# Altium schematic sheet 28. BOARD ID & 40 Pin EXP Hdr.SchDoc: BOARD ID EEPROM & 40 PIN EXP HEADER
size 513 x 386 mm; Project: PROC154E2(001)_SK_AM69; Issue: 1.0; RevCode: E3; Page Create Date: March  8, 1995; Variant Name: Core Design; Schematic Page Number: 28; Page Number: 28; Page Size: C; Comment: MISTRAL_TITLEBLK_CSIZE_1; Page Count: 62; Schematic Page Count: 62; Name: PROC154E2 001 SK AM69; DsnPath: C:\Users\danie\Downloads\sprr466c\PROC154E3_RP\PROC154E3_SCH.DSN; SchematicName: SCHEMATIC1; PageName: 28. BOARD ID & 40 Pin EXP Hdr; PageSize: C; TopSchematic: True
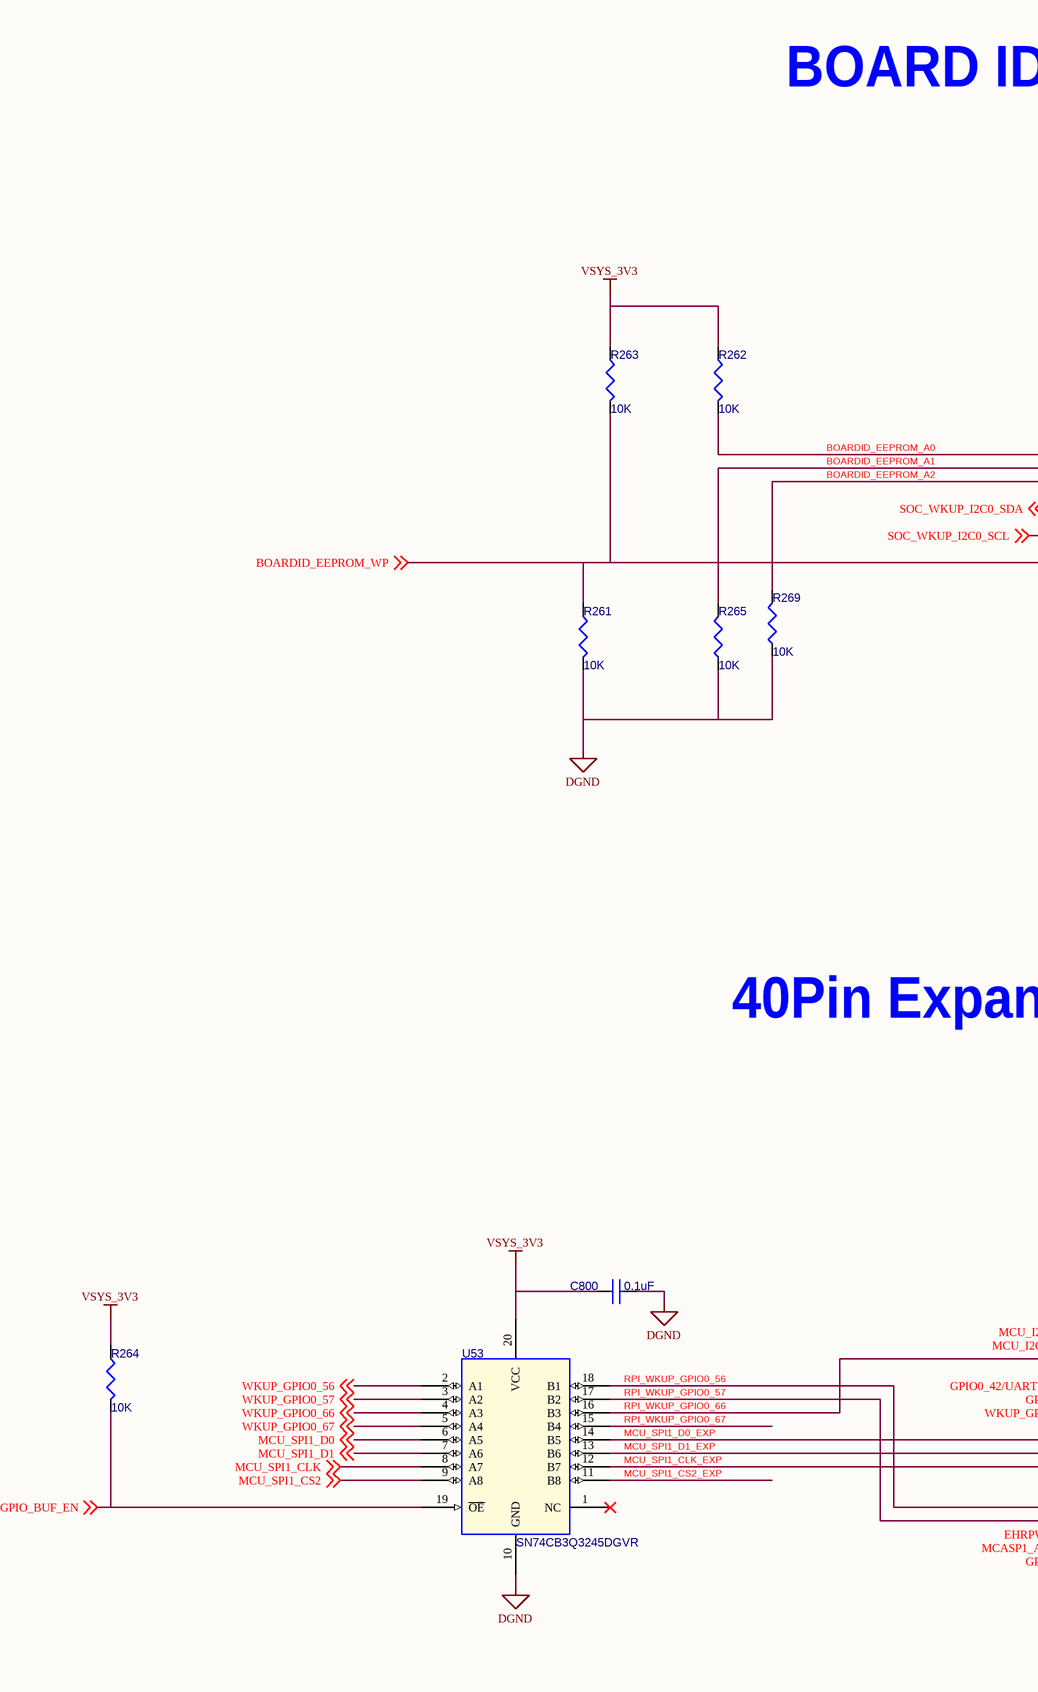
[diagram p0: 28. BOARD ID & 40 Pin EXP Hdr.SchDoc, left]
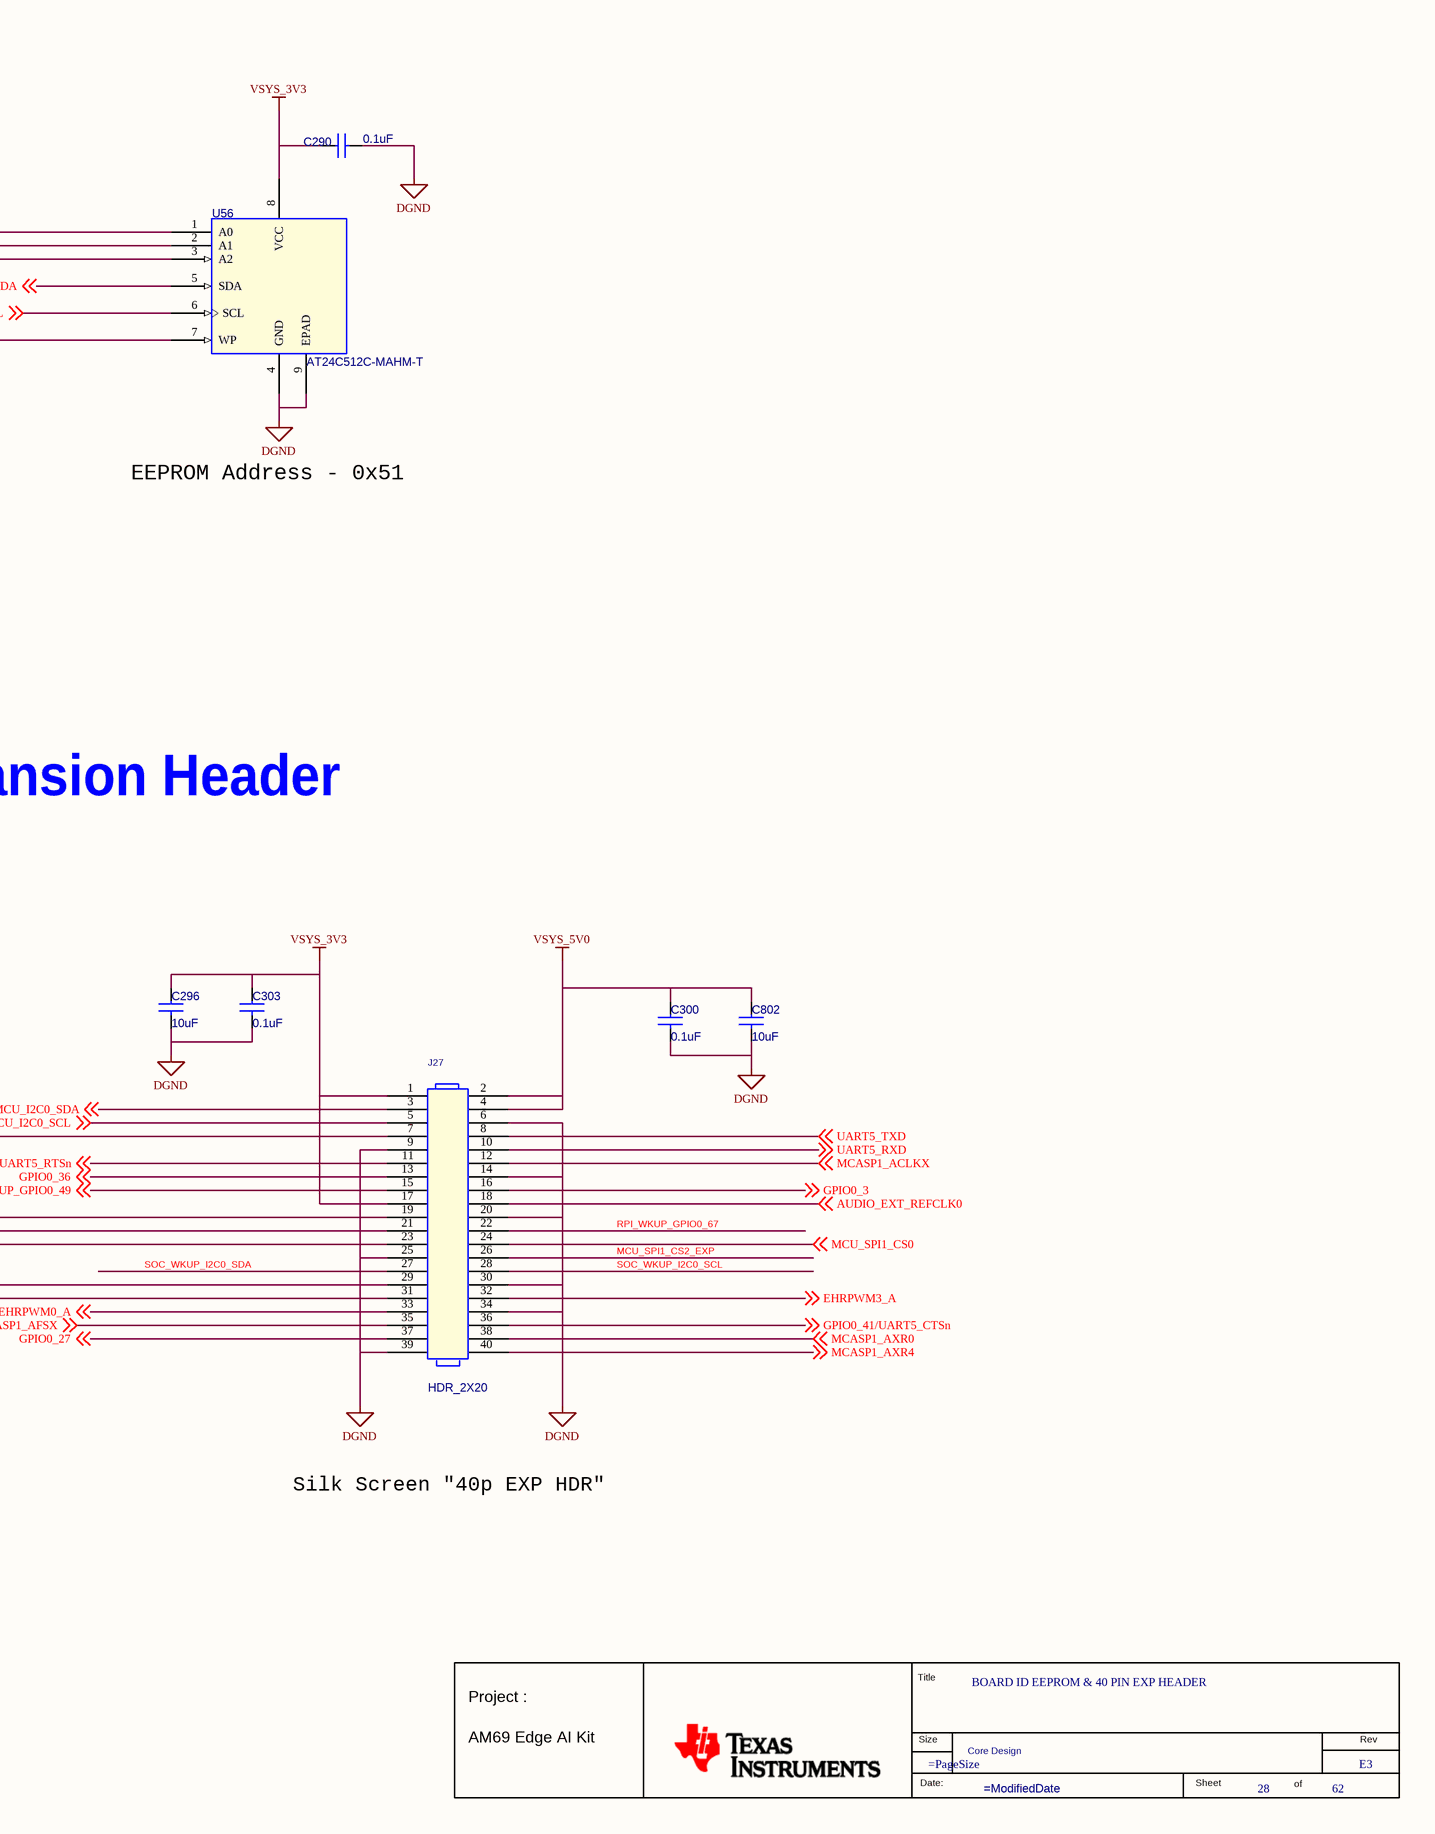
[diagram p1: 28. BOARD ID & 40 Pin EXP Hdr.SchDoc, right]

## Parts
*  RevCode: E3  Title: BOARD ID EEPROM & 40 PIN EXP HEADER  Page Number: 28  Page Count: 62  Variant Name: Core Design  (hidden comment: MISTRAL_TITLEBLK_CSIZE_1)  (graphical)
C290  0.1uF  [CAP0201_0-5]
C296  10uF  [CAP0402_1]
C300  0.1uF  [CAP0201_0-5]
C303  0.1uF  [CAP0201_0-5]
C800  0.1uF  [CAP0201_0-5]
C802  10uF  [CAP0402_1]
J27  HDR_2X20  [HDR_2X20_61304021121_S_T_8-6]
R261  10K  [RES0201_0-5]
R262  10K  [RES0201_0-5]
R263  10K  [RES0201_0-5]
R264  10K  [RES0201_0-5]
R265  10K  [RES0201_0-5]
R269  10K  [RES0201_0-5]
U53  SN74CB3Q3245DGVR  [TVSOP20_15-74_180X200]
U56  AT24C512C-MAHM-T  [UDFN8_19-68_120X80_0-6]

## Nets
DGND: C290.2 C296.2 C300.2 C303.2 C800.2 C802.2 J27.6 J27.9 J27.14 J27.20 J27.25 J27.30 J27.34 J27.39 R261.2 R265.1 R269.1 U53.10(GND) U56.4(GND) U56.9(EPAD)
VSYS_3V3: C290.1 C296.1 C303.1 C800.1 J27.1 J27.17 R262.1 R263.1 R264.1 U53.20(VCC) U56.8(VCC)
VSYS_5V0: C300.1 C802.1 J27.2 J27.4
AUDIO_EXT_REFCLK0: J27.18 ; off-sheet AUDIO_EXT_REFCLK0
BOARDID_EEPROM_A0: R262.2 U56.1(A0)
BOARDID_EEPROM_A1: R265.2 U56.2(A1)
BOARDID_EEPROM_A2: R269.2 U56.3(A2)
BOARDID_EEPROM_WP: R261.1 R263.2 U56.7(WP) ; off-sheet BOARDID_EEPROM_WP
EHRPWM0_A: J27.33 ; off-sheet EHRPWM0_A
EHRPWM3_A: J27.32 ; off-sheet EHRPWM3_A
GPIO0_3: J27.16 ; off-sheet GPIO0_3
GPIO0_27: J27.37 ; off-sheet GPIO0_27
GPIO0_36: J27.13 ; off-sheet GPIO0_36
GPIO0_41/UART5_CTSn: J27.36 ; off-sheet GPIO0_41/UART5_CTSn
GPIO0_42/UART5_RTSn: J27.11 ; off-sheet GPIO0_42/UART5_RTSn
MCASP1_ACLKX: J27.12 ; off-sheet MCASP1_ACLKX
MCASP1_AFSX: J27.35 ; off-sheet MCASP1_AFSX
MCASP1_AXR0: J27.38 ; off-sheet MCASP1_AXR0
MCASP1_AXR4: J27.40 ; off-sheet MCASP1_AXR4
MCU_I2C0_SCL: J27.5 ; off-sheet MCU_I2C0_SCL
MCU_I2C0_SDA: J27.3 ; off-sheet MCU_I2C0_SDA
MCU_SPI1_CLK: U53.8(A7) ; off-sheet MCU_SPI1_CLK
MCU_SPI1_CLK_EXP: J27.23 U53.12(B7)
MCU_SPI1_CS0: J27.24 ; off-sheet MCU_SPI1_CS0
MCU_SPI1_CS2: U53.9(A8) ; off-sheet MCU_SPI1_CS2
MCU_SPI1_CS2_EXP: J27.26 U53.11(B8)
MCU_SPI1_D0: U53.6(A5) ; off-sheet MCU_SPI1_D0
MCU_SPI1_D0_EXP: J27.19 U53.14(B5)
MCU_SPI1_D1: U53.7(A6) ; off-sheet MCU_SPI1_D1
MCU_SPI1_D1_EXP: J27.21 U53.13(B6)
RPi_GPIO_BUF_EN: R264.2 U53.19(~{OE}) ; off-sheet RPi_GPIO_BUF_EN
RPI_WKUP_GPIO0_56: J27.29 U53.18(B1)
RPI_WKUP_GPIO0_57: J27.31 U53.17(B2)
RPI_WKUP_GPIO0_66: J27.7 U53.16(B3)
RPI_WKUP_GPIO0_67: J27.22 U53.15(B4)
SOC_WKUP_I2C0_SCL: J27.28 U56.6(SCL) ; off-sheet SOC_WKUP_I2C0_SCL
SOC_WKUP_I2C0_SDA: J27.27 U56.5(SDA) ; off-sheet SOC_WKUP_I2C0_SDA
UART5_RXD: J27.10 ; off-sheet UART5_RXD
UART5_TXD: J27.8 ; off-sheet UART5_TXD
WKUP_GPIO0_49: J27.15 ; off-sheet WKUP_GPIO0_49
WKUP_GPIO0_56: U53.2(A1) ; off-sheet WKUP_GPIO0_56
WKUP_GPIO0_57: U53.3(A2) ; off-sheet WKUP_GPIO0_57
WKUP_GPIO0_66: U53.4(A3) ; off-sheet WKUP_GPIO0_66
WKUP_GPIO0_67: U53.5(A4) ; off-sheet WKUP_GPIO0_67

Not connected (* = marked no-connect by the designer): U53 1(NC)*

## Notes on the sheet
- BOARD ID EEPROM
- EEPROM Address - 0x51
- 40Pin Expansion Header
- Silk Screen "40p EXP HDR"
- (in symbol MISTRAL_TITLEBLK_CSIZE_1) Title; Project :; Size; Rev; AM69 Edge AI Kit; Date:; Sheet; of

## Library data of the parts
* = MISTRAL_TITLEBLK_CSIZE_1: Issue: 1.0; Project: PROC154E2(001)_SK_AM69; Name: PROC154E2 001 SK AM69; Page Create Date: March  8, 1995; Page Size: =PageSize; Page Modify Date: =ModifiedDate; Schematic Page Count: 62; Schematic Page Number: 28
C290 = CAP_Dup1: CAP CERAMIC 0.1uF 16V 10% X7S AUTO 0201; Part Reference: C290; Mistral Part No: 120021030007-R; Mfr_name: MURATA; Mfr_part_number: GRT033C71C104KE01D; Part_type: CAPACITORS\CERAMIC; Project: J7ES_SK_BRD; Wattage: NA; Customs_HS_Code: 85322990; Custom_Duty: 15%; Value: 0.1uF; Tolerance: 10%; Voltage: 16V; Package: 0201; Distributor_name: DIGIKEY; Distributor_part_number: 490-GRT033C71C104KE01DTR-ND; Height: 0.33MM; Weight: 330mg; Temperature: -55°C+125°C; Datasheet: Y:\MIS_DATABASE\DATASHEETS\CAPACITORS\GRT033C71C104KE01.PDF; Crtd /date: ALVY/110321; Chkd/date: MANIRAJA/110321; MECHANICAL 3D STEP FILE: CAP0201_0-5; PCB Footprint: CAP0201_0-5
C296 = CAP_Dup1: CAP CERAMIC 10uF 10V 20% X5R 0402; Part Reference: C296; Part_type: CAPACITORS\CERAMIC; Mfr_part_number: CL05A106MP8NUB8; Mfr_name: SAMSUNG; Mistral Part No: 120019020008-R; Custom_Duty: 15%; Customs_HS_Code: 85322990; Wattage: NA; Project: TI_60GHz-AOP; Value: 10uF; PCB Footprint: CAP0402_1; Footprint Path: Y:\MIS_DATABASE\Library\ALTIUM_TOOL\PCB_FOOTPRINTS\Altium_Footprint_Lib.PcbLib; Library Path: Y:\MIS_DATABASE\Library\ALTIUM_TOOL\SCHEMATICS_PARTS\MS_DISCRETE_Library.schlib; MECHANICAL 3D STEP FILE: CAP0402_1; Chkd/date: MANIRAJA/150219; Crtd /date: ALVY/150219; Datasheet: Y:\MIS_DATABASE\DATASHEETS\CAPACITORS\CL05A106MP8NUB8.PDF; Temperature: -55°C+85°C; Weight: NA; Height: 0.90MM; Footprint Ref: CAP0402_1; Library Ref: CAP; Distributor_part_number: 1276-6830-1-ND; Distributor_name: DIGIKEY; Package: 0402; Voltage: 10V; Tolerance: 20%
C300 = CAP_Dup1: CAP CERAMIC 0.1uF 16V 10% X7S AUTO 0201; Part Reference: C300; Part_type: CAPACITORS\CERAMIC; Mfr_part_number: GRT033C71C104KE01D; Mfr_name: MURATA; Mistral Part No: 120021030007-R; Custom_Duty: 15%; Customs_HS_Code: 85322990; Wattage: NA; Project: J7ES_SK_BRD; Value: 0.1uF; PCB Footprint: CAP0201_0-5; MECHANICAL 3D STEP FILE: CAP0201_0-5; Chkd/date: MANIRAJA/110321; Crtd /date: ALVY/110321; Datasheet: Y:\MIS_DATABASE\DATASHEETS\CAPACITORS\GRT033C71C104KE01.PDF; Temperature: -55°C+125°C; Weight: 330mg; Height: 0.33MM; Distributor_part_number: 490-GRT033C71C104KE01DTR-ND; Distributor_name: DIGIKEY; Package: 0201; Voltage: 16V; Tolerance: 10%
C303 = CAP_Dup1: CAP CERAMIC 0.1uF 16V 10% X7S AUTO 0201; Part Reference: C303; Mistral Part No: 120021030007-R; Mfr_name: MURATA; Mfr_part_number: GRT033C71C104KE01D; Part_type: CAPACITORS\CERAMIC; Project: J7ES_SK_BRD; Wattage: NA; Customs_HS_Code: 85322990; Custom_Duty: 15%; Value: 0.1uF; PCB Footprint: CAP0201_0-5; Tolerance: 10%; Voltage: 16V; Package: 0201; Distributor_name: DIGIKEY; Distributor_part_number: 490-GRT033C71C104KE01DTR-ND; Height: 0.33MM; Weight: 330mg; Temperature: -55°C+125°C; Datasheet: Y:\MIS_DATABASE\DATASHEETS\CAPACITORS\GRT033C71C104KE01.PDF; Crtd /date: ALVY/110321; Chkd/date: MANIRAJA/110321; MECHANICAL 3D STEP FILE: CAP0201_0-5
C800 = CAP_Dup1: CAP CERAMIC 0.1uF 16V 10% X7S AUTO 0201; Part Reference: C800; Mistral Part No: 120021030007-R; Mfr_name: MURATA; Mfr_part_number: GRT033C71C104KE01D; Part_type: CAPACITORS\CERAMIC; Project: J7ES_SK_BRD; Wattage: NA; Customs_HS_Code: 85322990; Custom_Duty: 15%; Value: 0.1uF; PCB Footprint: CAP0201_0-5; Tolerance: 10%; Voltage: 16V; Package: 0201; Distributor_name: DIGIKEY; Distributor_part_number: 490-GRT033C71C104KE01DTR-ND; Height: 0.33MM; Weight: 330mg; Temperature: -55°C+125°C; Datasheet: Y:\MIS_DATABASE\DATASHEETS\CAPACITORS\GRT033C71C104KE01.PDF; Crtd /date: ALVY/110321; Chkd/date: MANIRAJA/110321; MECHANICAL 3D STEP FILE: CAP0201_0-5
C802 = CAP_Dup1: CAP CERAMIC 10uF 10V 20% X5R 0402; Part Reference: C802; Mistral Part No: 120019020008-R; Mfr_name: SAMSUNG; Mfr_part_number: CL05A106MP8NUB8; Part_type: CAPACITORS\CERAMIC; Project: TI_60GHz-AOP; Wattage: NA; Customs_HS_Code: 85322990; Custom_Duty: 15%; Value: 10uF; PCB Footprint: CAP0402_1; Tolerance: 20%; Voltage: 10V; Package: 0402; Distributor_name: DIGIKEY; Distributor_part_number: 1276-6830-1-ND; Library Ref: CAP; Footprint Ref: CAP0402_1; Height: 0.90MM; Weight: NA; Temperature: -55°C+85°C; Datasheet: Y:\MIS_DATABASE\DATASHEETS\CAPACITORS\CL05A106MP8NUB8.PDF; Crtd /date: ALVY/150219; Chkd/date: MANIRAJA/150219; MECHANICAL 3D STEP FILE: CAP0402_1; Library Path: Y:\MIS_DATABASE\Library\ALTIUM_TOOL\SCHEMATICS_PARTS\MS_DISCRETE_Library.schlib; Footprint Path: Y:\MIS_DATABASE\Library\ALTIUM_TOOL\PCB_FOOTPRINTS\Altium_Footprint_Lib.PcbLib
J27 = HEADER_20X2: CON HDR 2X20 2.54MM PITCH ST TH; Part Reference: J27; Mistral Part No: 150021010011-R; Mfr_name: WURTH ELEKTRONIK; Mfr_part_number: 61304021121; Part_type: CONNECTOR\HEADERS; Project: TI_DRA829 SK EVM BRD; Tolerance: NA; Customs_HS_Code: 85369090; Custom_Duty: 24%; Value: HDR_2X20; PCB Footprint: HDR_2X20_61304021121_S_T_8-6; Footprint Ref: HDR_2X20_61304021121_S_T_8-6; Voltage: NA; Wattage: NA; Package: THRU-HOLE; Distributor_name: DIGIKEY; Distributor_part_number: 732-5310-ND; Library Ref: HEADER_20X2; Height: 8.54MM; Weight: 2250mg; Temperature: -40°C+105°C; Datasheet: Y:\MIS_DATABASE\DATASHEETS\CONNECTORS\6130XX21121.PDF; Crtd /date: ALVY/070121; Chkd/date: MANIRAJA/080121; MECHANICAL 3D STEP FILE: HDR_2X20_61304021121_S_T_8-6; Library Path: Y:\MIS_DATABASE\Library\ALTIUM_TOOL\SCHEMATICS_PARTS\MS_CONNECTOR_Library.schlib; Footprint Path: Y:\MIS_DATABASE\Library\ALTIUM_TOOL\PCB_FOOTPRINTS\Altium_Footprint_Lib.PcbLib
R261 = RESISTOR_Dup2: RES 10K 1/20W 5% 0201; Part Reference: R261; Part_type: RESISTORS\FIXED; Mfr_part_number: RC0201JR-0710KL; Mfr_name: YAGEO AMERICA; Mistral Part No: 110010070051-R; Custom_Duty: 15%; Customs_HS_Code: 85332119; Voltage: NA; Project: GOLDEN-I LITE; Value: 10K; PCB Footprint: RES0201_0-5; Footprint Path: Y:\MIS_DATABASE\Library\ALTIUM_TOOL\PCB_FOOTPRINTS\Altium_Footprint_Lib.PcbLib; Library Path: Y:\MIS_DATABASE\Library\ALTIUM_TOOL\SCHEMATICS_PARTS\MS_DISCRETE_Library.schlib; Footprint Ref: RES0201_0-5; Library Ref: RESISTOR; MECHANICAL 3D STEP FILE: RES0201_0-5; Chkd/date: MANIRAJA/050517; Crtd /date: MANIRAJA/050517; Datasheet: Y:\MIS_DATABASE\DATASHEETS\RESISTORS\RCXXXXL-SER_MAR18.PDF; Temperature: -55°C+125°C; Weight: 0.17mg; Height: 0.26MM; Distributor_part_number: 311-10KNCT-ND; Distributor_name: DIGIKEY; Package: 0201; Wattage: 1/20W; Tolerance: 5%
R262 = RESISTOR_Dup2: RES 10K 1/20W 5% 0201; Part Reference: R262; Mistral Part No: 110010070051-R; Mfr_name: YAGEO AMERICA; Mfr_part_number: RC0201JR-0710KL; Part_type: RESISTORS\FIXED; Project: GOLDEN-I LITE; Voltage: NA; Customs_HS_Code: 85332119; Custom_Duty: 15%; Value: 10K; PCB Footprint: RES0201_0-5; Footprint Path: Y:\MIS_DATABASE\Library\ALTIUM_TOOL\PCB_FOOTPRINTS\Altium_Footprint_Lib.PcbLib; Library Path: Y:\MIS_DATABASE\Library\ALTIUM_TOOL\SCHEMATICS_PARTS\MS_DISCRETE_Library.schlib; Footprint Ref: RES0201_0-5; Library Ref: RESISTOR; Tolerance: 5%; Wattage: 1/20W; Package: 0201; Distributor_name: DIGIKEY; Distributor_part_number: 311-10KNCT-ND; Height: 0.26MM; Weight: 0.17mg; Temperature: -55°C+125°C; Datasheet: Y:\MIS_DATABASE\DATASHEETS\RESISTORS\RCXXXXL-SER_MAR18.PDF; Crtd /date: MANIRAJA/050517; Chkd/date: MANIRAJA/050517; MECHANICAL 3D STEP FILE: RES0201_0-5
R263 = RESISTOR_Dup2: RES 10K 1/20W 5% 0201; Part Reference: R263; Part_type: RESISTORS\FIXED; Mfr_part_number: RC0201JR-0710KL; Mfr_name: YAGEO AMERICA; Mistral Part No: 110010070051-R; Custom_Duty: 15%; Customs_HS_Code: 85332119; Voltage: NA; Project: GOLDEN-I LITE; Value: 10K; PCB Footprint: RES0201_0-5; Footprint Path: Y:\MIS_DATABASE\Library\ALTIUM_TOOL\PCB_FOOTPRINTS\Altium_Footprint_Lib.PcbLib; Library Path: Y:\MIS_DATABASE\Library\ALTIUM_TOOL\SCHEMATICS_PARTS\MS_DISCRETE_Library.schlib; Footprint Ref: RES0201_0-5; Library Ref: RESISTOR; MECHANICAL 3D STEP FILE: RES0201_0-5; Chkd/date: MANIRAJA/050517; Crtd /date: MANIRAJA/050517; Datasheet: Y:\MIS_DATABASE\DATASHEETS\RESISTORS\RCXXXXL-SER_MAR18.PDF; Temperature: -55°C+125°C; Weight: 0.17mg; Height: 0.26MM; Distributor_part_number: 311-10KNCT-ND; Distributor_name: DIGIKEY; Package: 0201; Wattage: 1/20W; Tolerance: 5%
R264 = RESISTOR_Dup2: RES 10K 1/20W 5% 0201; Part Reference: R264; Mistral Part No: 110010070051-R; Mfr_name: YAGEO AMERICA; Mfr_part_number: RC0201JR-0710KL; Part_type: RESISTORS\FIXED; Project: GOLDEN-I LITE; Voltage: NA; Customs_HS_Code: 85332119; Custom_Duty: 15%; Value: 10K; PCB Footprint: RES0201_0-5; Footprint Path: Y:\MIS_DATABASE\Library\ALTIUM_TOOL\PCB_FOOTPRINTS\Altium_Footprint_Lib.PcbLib; Library Path: Y:\MIS_DATABASE\Library\ALTIUM_TOOL\SCHEMATICS_PARTS\MS_DISCRETE_Library.schlib; Footprint Ref: RES0201_0-5; Library Ref: RESISTOR; Tolerance: 5%; Wattage: 1/20W; Package: 0201; Distributor_name: DIGIKEY; Distributor_part_number: 311-10KNCT-ND; Height: 0.26MM; Weight: 0.17mg; Temperature: -55°C+125°C; Datasheet: Y:\MIS_DATABASE\DATASHEETS\RESISTORS\RCXXXXL-SER_MAR18.PDF; Crtd /date: MANIRAJA/050517; Chkd/date: MANIRAJA/050517; MECHANICAL 3D STEP FILE: RES0201_0-5
R265 = RESISTOR_Dup2: RES 10K 1/20W 5% 0201; Part Reference: R265; Part_type: RESISTORS\FIXED; Mfr_part_number: RC0201JR-0710KL; Mfr_name: YAGEO AMERICA; Mistral Part No: 110010070051-R; Custom_Duty: 15%; Customs_HS_Code: 85332119; Voltage: NA; Project: GOLDEN-I LITE; Value: 10K; PCB Footprint: RES0201_0-5; MECHANICAL 3D STEP FILE: RES0201_0-5; Chkd/date: MANIRAJA/050517; Crtd /date: MANIRAJA/050517; Datasheet: Y:\MIS_DATABASE\DATASHEETS\RESISTORS\RCXXXXL-SER_MAR18.PDF; Temperature: -55°C+125°C; Weight: 0.17mg; Height: 0.26MM; Distributor_part_number: 311-10KNCT-ND; Distributor_name: DIGIKEY; Package: 0201; Wattage: 1/20W; Tolerance: 5%; Library Ref: RESISTOR; Footprint Ref: RES0201_0-5; Library Path: Y:\MIS_DATABASE\Library\ALTIUM_TOOL\SCHEMATICS_PARTS\MS_DISCRETE_Library.schlib; Footprint Path: Y:\MIS_DATABASE\Library\ALTIUM_TOOL\PCB_FOOTPRINTS\Altium_Footprint_Lib.PcbLib
R269 = RESISTOR_Dup2: RES 10K 1/20W 5% 0201; Part Reference: R269; Mistral Part No: 110010070051-R; Mfr_name: YAGEO AMERICA; Mfr_part_number: RC0201JR-0710KL; Part_type: RESISTORS\FIXED; Project: GOLDEN-I LITE; Voltage: NA; Customs_HS_Code: 85332119; Custom_Duty: 15%; Value: 10K; PCB Footprint: RES0201_0-5; Tolerance: 5%; Wattage: 1/20W; Package: 0201; Distributor_name: DIGIKEY; Distributor_part_number: 311-10KNCT-ND; Height: 0.26MM; Weight: 0.17mg; Temperature: -55°C+125°C; Datasheet: Y:\MIS_DATABASE\DATASHEETS\RESISTORS\RCXXXXL-SER_MAR18.PDF; Crtd /date: MANIRAJA/050517; Chkd/date: MANIRAJA/050517; MECHANICAL 3D STEP FILE: RES0201_0-5; Library Ref: RESISTOR; Footprint Ref: RES0201_0-5; Library Path: Y:\MIS_DATABASE\Library\ALTIUM_TOOL\SCHEMATICS_PARTS\MS_DISCRETE_Library.schlib; Footprint Path: Y:\MIS_DATABASE\Library\ALTIUM_TOOL\PCB_FOOTPRINTS\Altium_Footprint_Lib.PcbLib
U53 = SN74CB3Q3245DGVR_TVSOP20: IC LOW VOLTAGE FET BUS SWITCH TVSOP20; Part Reference: U53; Mistral Part No: 141009030114-R; Mfr_name: TEXAS INSTRUMENTS; Part_type: ICS\DIGITAL\COMBINATIONAL; Project: KHAN_HSST; Customs_HS_Code: 85423100; Custom_Duty: 15%; Value: SN74CB3Q3245DGVR; PCB Footprint: TVSOP20_15-74_180X200; Mfr_part_number: SN74CB3Q3245DGVR; Package: TVSOP20; Distributor_name: DIGIKEY; Distributor_part_number: 296-19129-1-ND; Library Ref: SN74CB3Q3245DGVR_TVSOP20; Height: 1.20MM; Datasheet: Y:\MIS_DATABASE\DATASHEETS\MISC\SWITCHES\SN74CB3Q3245.PDF; Crtd /date: USMAN/121208; Chkd/date: MAZHAR/160208; RoHS: Sb/ Br FREE
U56 = AT24C64D-MAHM-T_UDFN8: IC 1.7-3.6V 512Kb I2C COMPATIBLE SERIAL EEPROM UDFN8; Part Reference: U56; Mistral Part No: 141119090004-R; Mfr_name: MICROCHIP; Part_type: ICS\DIGITAL\MEMORY; Project: HAL_3U-T1042-SBC; Tolerance: NA; Customs_HS_Code: 85423100; Custom_Duty: 15%; Value: AT24C512C-MAHM-T; Footprint Ref: UDFN8_19-68_120X80_0-6; Mfr_part_number: AT24C512C-MAHM-T; Voltage: NA; Wattage: NA; Package: UDFN8; Distributor_name: DIGIKEY; Distributor_part_number: AT24C512C-MAHM-TCT-ND; Library Ref: AT24C64D-MAHM-T_UDFN8; Height: 0.60MM; Weight: 9.5mg; Temperature: -40°C+85°C; Datasheet: Y:\MIS_DATABASE\DATASHEETS\ICS\MEMORY\AT24C512C.PDF; Crtd /date: ALVY/240919; Chkd/date: MANIRAJA/240919; MECHANICAL 3D STEP FILE: UDFN8_19-68_120X80_0-6; Library Path: Y:\MIS_DATABASE\Library\ALTIUM_TOOL\SCHEMATICS_PARTS\MS_MISCMEMORY_Library.schlib; Footprint Path: Y:\MIS_DATABASE\Library\ALTIUM_TOOL\PCB_FOOTPRINTS\Altium_Footprint_Lib.PcbLib; PCB Footprint: UDFN8_19-68_120X80_0-6